# EasyEDA schematic 1-Schematic_Smart Flood Detection System, PCB Design for Raspberry with camera and buzzer.json
TITLE: Schematic; REV: 1.0; Date: 2020-05-28; Sheet: 1/1; Drawn By: akunwar; Company: Deakin University
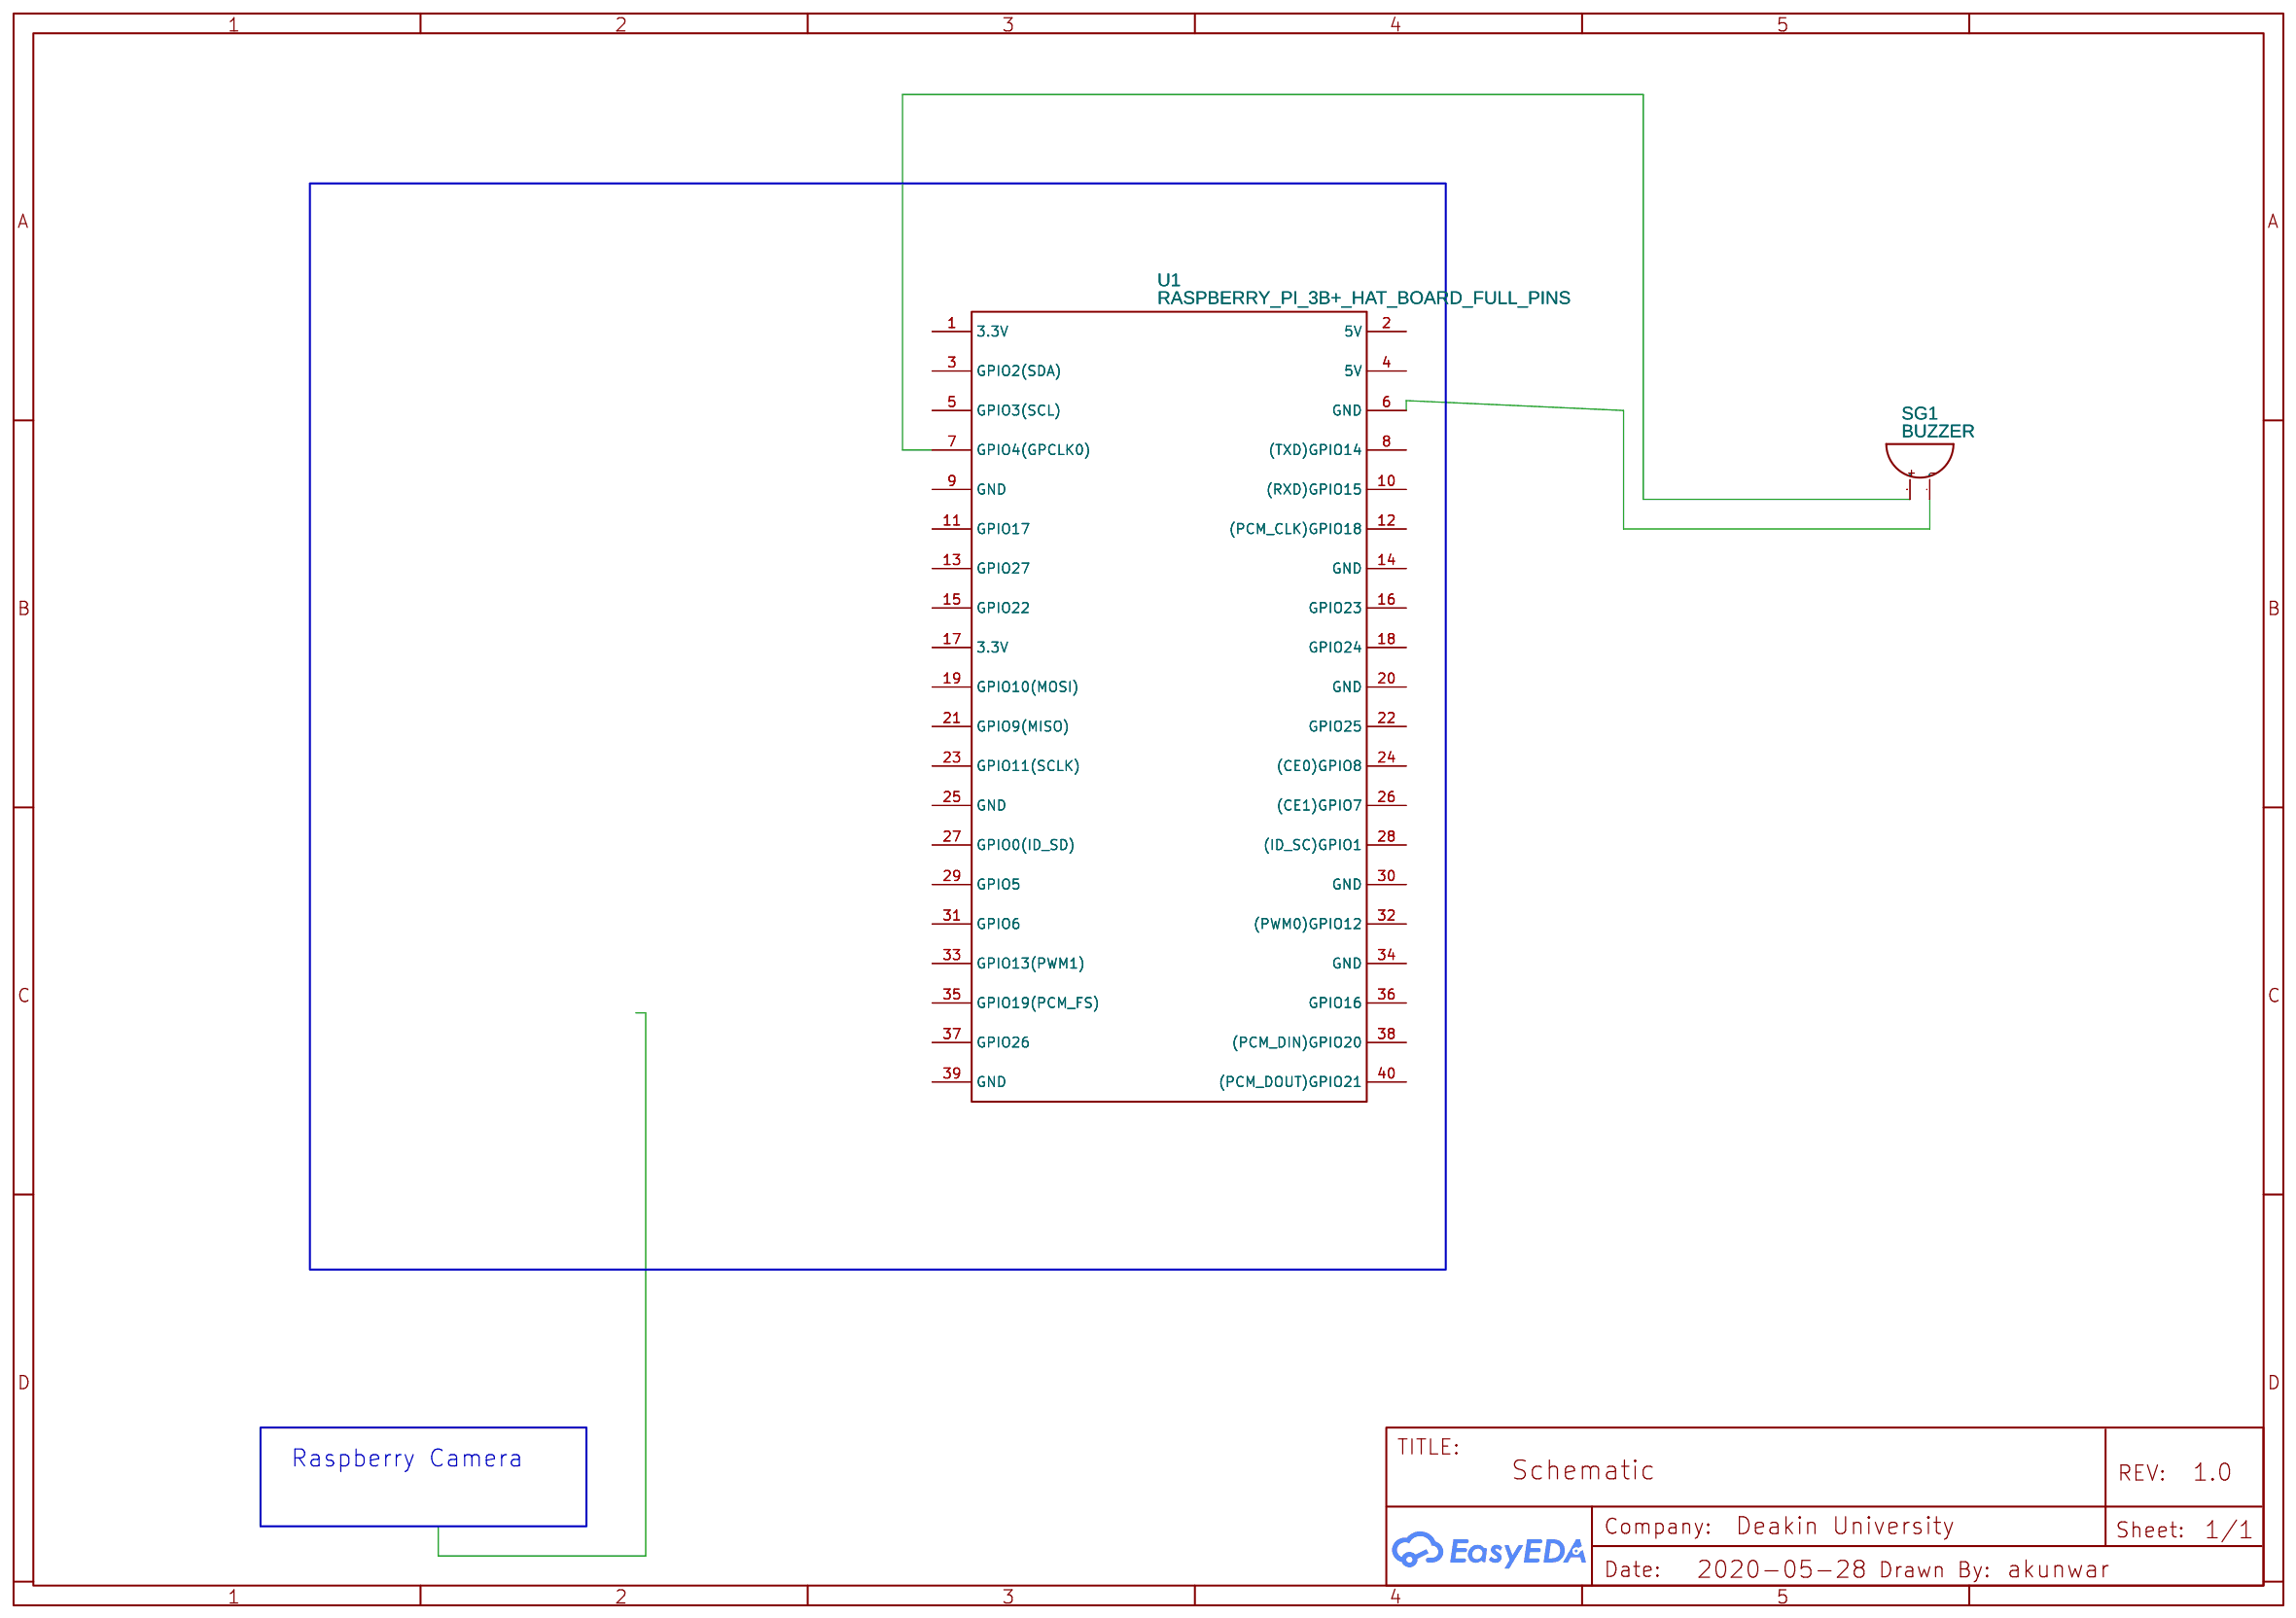
[diagram p0: schematic sheet]

## Parts
SG1  BUZZER  [BUZZER-12MM-KIT]
U1  RASPBERRY_PI_3B+_HAT_BOARD_FULL_PINS  [RASPBERRY_PI_3B_PLUS_HAT_BOARD]

## Library data of the parts
SG1 = BUZZER: Contributor: SparkFun
U1 = RASPBERRY_PI_3B_PLUS_HAT_BOARD_FULL_PINS: catid: 20; Contributor: lwweb; Manufacturer Part: Raspberry-Pi-3B-Plus-HAT-Board

## Nets
Net-(SG1-+): SG1.+(1) U1.7(GPIO4(GPCLK0))
Net-(SG1--): SG1.-(2) U1.6(GND)

Not connected (* = marked no-connect by the designer): U1 1(3.3V) 2(5V) 3(GPIO2(SDA)) 4(5V) 5(GPIO3(SCL)) 8((TXD)GPIO14) 9(GND) 10((RXD)GPIO15) 11(GPIO17) 12((PCM_CLK)GPIO18) 13(GPIO27) 14(GND) 15(GPIO22) 16(GPIO23) 17(3.3V) 18(GPIO24) 19(GPIO10(MOSI)) 20(GND) 21(GPIO9(MISO)) 22(GPIO25) 23(GPIO11(SCLK)) 24((CE0)GPIO8) 25(GND) 26((CE1)GPIO7) 27(GPIO0(ID_SD)) 28((ID_SC)GPIO1) 29(GPIO5) 30(GND) 31(GPIO6) 32((PWM0)GPIO12) 33(GPIO13(PWM1)) 34(GND) 35(GPIO19(PCM_FS)) 36(GPIO16) 37(GPIO26) 38((PCM_DIN)GPIO20) 39(GND) 40((PCM_DOUT)GPIO21)

## Notes on the sheet
- Raspberry Camera
